# Altium schematic sheet Fonte.SchDoc: Ararinha 6F
size A4; Revision: 2.0; SheetNumber: 7; SheetTotal: 7
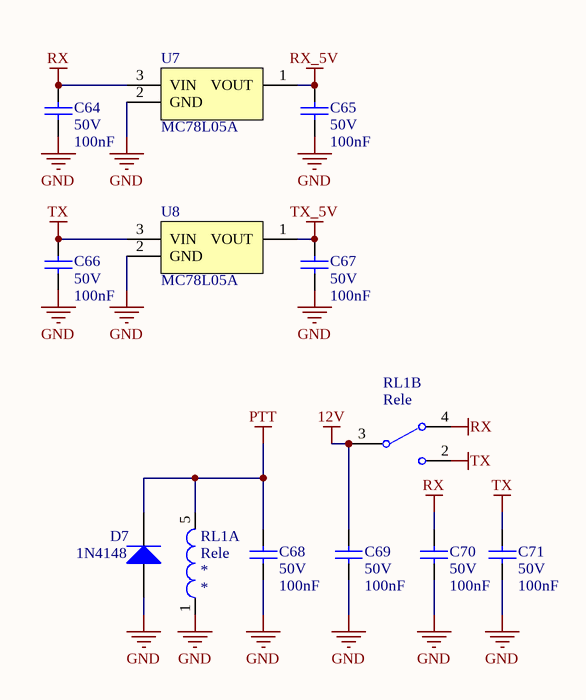
[diagram p0: Fonte.SchDoc]

## Parts
C64  value 100nF  Tensão: 50V  [CC0603]  (hidden comment: Capacitor Cerâmico)
C65  value 100nF  Tensão: 50V  [CC0603]  (hidden comment: Capacitor Cerâmico)
C66  value 100nF  Tensão: 50V  [CC0603]  (hidden comment: Capacitor Cerâmico)
C67  value 100nF  Tensão: 50V  [CC0603]  (hidden comment: Capacitor Cerâmico)
C68  value 100nF  Tensão: 50V  [CC0603]  (hidden comment: Capacitor Cerâmico)
C69  value 100nF  Tensão: 50V  [CC0603]  (hidden comment: Capacitor Cerâmico)
C70  value 100nF  Tensão: 50V  [CC0603]  (hidden comment: Capacitor Cerâmico)
C71  value 100nF  Tensão: 50V  [CC0603]  (hidden comment: Capacitor Cerâmico)
D7  1N4148  [SOD-323 Diodo-K2]
RL1  Rele  [Rele SPDT]  (parts A,B of 2)
U7  MC78L05A  [SOT-89-3N]
U8  MC78L05A  [SOT-89-3N]

## Nets
12V: C69.2 RL1.3(C)
GND: C64.1 C65.1 C66.1 C67.1 C68.1 C69.1 C70.1 C71.1 D7.1(A) RL1.1(L1) U7.2(GND) U8.2(GND)
PTT: C68.2 D7.2(K) RL1.5(L2)
RX: C64.2 C70.2 RL1.4(NF) U7.3(VIN)
RX_5V: C65.2 U7.1(VOUT)
TX: C66.2 C71.2 RL1.2(NA) U8.3(VIN)
TX_5V: C67.2 U8.1(VOUT)

## Notes on the sheet
- Projeto:
- Tamanho:
- Data:
- A4
- Eng. Felipe Navarro
- Hora:
- Revisão:
- Folha
- de
- Arquivo:

## Library data of the parts
C64-C71 = Cap 100nF 50V 0603 X7R: Capacitor (Semiconductor SIM Model); Chinês: Local; ChinesePrice: 0,00250; Corrente: *A; Potência: *W; Obs:: X7R; Tolerância: ±10%; Supplier 1: Digi-Key; Supplier Part Number 1: 1276-1000-1-ND; ComponentLink1Description: Datasheet; ComponentLink1URL: D:\Tecnoclade\Datasheet\!DataMissing.pdf
D7 = DP 75V 150mA SOD-323: Small Signal Diodes; ChinesePrice: 0,00000; Chinês: ----; Obs:: Small Signal =< 200mA (Io), Any Speed; Supplier 1: Digi-Key; Supplier Part Number 1: 1N4148WSFSCT-ND; Potência: *; Value: *; Tolerância: *; ComponentLink1Description: Datasheet; ComponentLink1URL: D:\Tecnoclade\Datasheet\!DataMissing.pdf
RL1 = Rele SPDT: Rele de uma chave e dois contatos; ChinesePrice: 0,00000; Chinês: ----; Potência: *; Supplier 1: Digi-Key; Supplier Part Number 1: --Del; Value: *; Obs:: *; Tolerância: *; ComponentLink1Description: Datasheet; ComponentLink1URL: D:\Tecnoclade\Datasheet\; Corrente: *; Tensão: *
U7 U8 = MC78L05: Regulador Linear 5V; Chinês: -----; Corrente: 100mA; ChinesePrice: 0,00000; Potência: *; Value: *; Supplier 1: Digi-Key; Supplier Part Number 1: MC78L05ACHXCT-ND; Tensão: 5V; Obs:: *; Tolerância: *; ComponentLink1Description: Datasheet; ComponentLink1URL: D:\Tecnoclade\Datasheet\